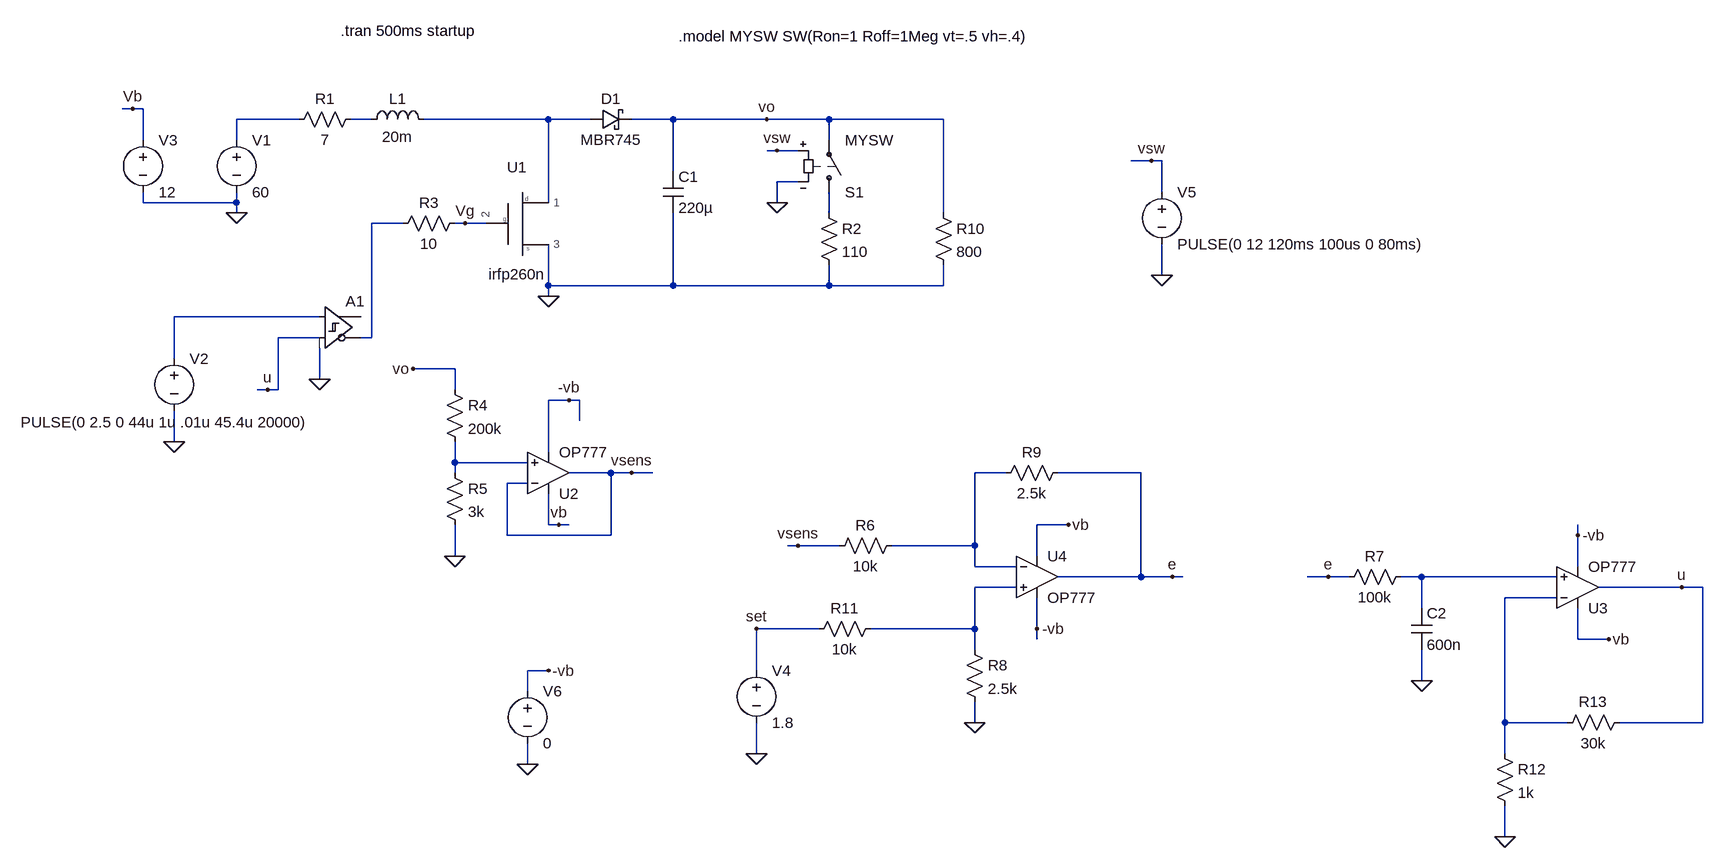
[diagram p0: schematic boost_control_integrator2.asc]
boost_control_integrator2.asc, the LTspice schematic file:
Version 4
SHEET 1 2184 1188
WIRE -240 48 -256 48
WIRE -224 48 -240 48
WIRE 16 64 -80 64
WIRE 128 64 96 64
WIRE 400 64 208 64
WIRE 464 64 400 64
WIRE 592 64 528 64
WIRE 736 64 592 64
WIRE 832 64 736 64
WIRE 1008 64 832 64
WIRE -224 96 -224 48
WIRE -80 96 -80 64
WIRE 832 96 832 64
WIRE 752 112 736 112
WIRE 784 112 752 112
WIRE 1328 128 1296 128
WIRE 1344 128 1328 128
WIRE 592 144 592 64
WIRE 784 160 752 160
WIRE 1344 176 1344 128
WIRE -224 192 -224 176
WIRE -80 192 -80 176
WIRE -80 192 -224 192
WIRE 400 192 400 64
WIRE 752 192 752 160
WIRE -80 208 -80 192
WIRE 832 208 832 176
WIRE 1008 208 1008 64
WIRE 176 224 128 224
WIRE 272 224 256 224
WIRE 304 224 272 224
WIRE 1344 304 1344 256
WIRE 400 320 400 256
WIRE 592 320 592 208
WIRE 592 320 400 320
WIRE 832 320 832 288
WIRE 832 320 592 320
WIRE 1008 320 1008 288
WIRE 1008 320 832 320
WIRE 400 336 400 320
WIRE 48 368 -176 368
WIRE 48 400 -16 400
WIRE 128 400 128 224
WIRE 128 400 112 400
WIRE -176 432 -176 368
WIRE 256 448 192 448
WIRE 48 464 48 416
WIRE -32 480 -48 480
WIRE -16 480 -16 400
WIRE -16 480 -32 480
WIRE 256 480 256 448
WIRE 432 496 400 496
WIRE 448 496 432 496
WIRE 448 528 448 496
WIRE -176 560 -176 512
WIRE 400 576 400 496
WIRE 256 592 256 560
WIRE 368 592 256 592
WIRE 256 608 256 592
WIRE 496 608 432 608
WIRE 528 608 496 608
WIRE 560 608 528 608
WIRE 1104 608 1056 608
WIRE 1312 608 1184 608
WIRE 368 624 336 624
WIRE 400 688 400 640
WIRE 416 688 400 688
WIRE 432 688 416 688
WIRE 1200 688 1152 688
WIRE 336 704 336 624
WIRE 496 704 496 608
WIRE 496 704 336 704
WIRE 1984 704 1984 688
WIRE 784 720 768 720
WIRE 848 720 784 720
WIRE 1056 720 1056 608
WIRE 1056 720 928 720
WIRE 256 736 256 688
WIRE 1152 736 1152 688
WIRE 1056 752 1056 720
WIRE 1120 752 1056 752
WIRE 1984 752 1984 704
WIRE 1312 768 1312 608
WIRE 1312 768 1184 768
WIRE 1360 768 1312 768
WIRE 1376 768 1360 768
WIRE 1600 768 1568 768
WIRE 1632 768 1600 768
WIRE 1744 768 1712 768
WIRE 1952 768 1744 768
WIRE 1120 784 1056 784
WIRE 2144 784 2016 784
WIRE 2176 784 2144 784
WIRE 1952 800 1872 800
WIRE 1744 816 1744 768
WIRE 816 848 720 848
WIRE 1056 848 1056 784
WIRE 1056 848 896 848
WIRE 1152 848 1152 800
WIRE 1152 864 1152 848
WIRE 1984 864 1984 816
WIRE 2032 864 1984 864
WIRE 1056 880 1056 848
WIRE 400 912 368 912
WIRE 720 912 720 848
WIRE 1744 928 1744 880
WIRE 368 944 368 912
WIRE 1056 992 1056 960
WIRE 1872 992 1872 800
WIRE 1968 992 1872 992
WIRE 2176 992 2176 784
WIRE 2176 992 2048 992
WIRE 720 1040 720 992
WIRE 1872 1040 1872 992
WIRE 368 1056 368 1024
WIRE 1872 1168 1872 1120
FLAG 400 336 0
FLAG -80 208 0
FLAG 736 64 vo
FLAG 48 464 0
FLAG -176 560 0
FLAG 272 224 Vg
FLAG -32 480 u
FLAG 192 448 vo
FLAG 256 736 0
FLAG -240 48 Vb
FLAG 1200 688 vb
FLAG 720 1040 0
FLAG 1056 992 0
FLAG 528 608 vsens
FLAG 784 720 vsens
FLAG 416 688 vb
FLAG 720 848 set
FLAG 752 192 0
FLAG 752 112 vsw
FLAG 1344 304 0
FLAG 1328 128 vsw
FLAG 368 1056 0
FLAG 400 912 -vb
FLAG 432 496 -vb
FLAG 1152 848 -vb
FLAG 1360 768 e
FLAG 2032 864 vb
FLAG 1984 704 -vb
FLAG 1744 928 0
FLAG 1872 1168 0
FLAG 1600 768 e
FLAG 2144 784 u
SYMBOL voltage -80 80 R0
WINDOW 123 0 0 Left 0
WINDOW 39 0 0 Left 0
SYMATTR InstName V1
SYMATTR Value 60
SYMBOL res 112 48 R90
WINDOW 0 0 56 VBottom 2
WINDOW 3 32 56 VTop 2
SYMATTR InstName R1
SYMATTR Value 7
SYMBOL ind 112 80 R270
WINDOW 0 32 56 VTop 2
WINDOW 3 5 56 VBottom 2
SYMATTR InstName L1
SYMATTR Value 20m
SYMATTR SpiceLine Rser=.5 Rpar=10Meg
SYMBOL cap 576 144 R0
SYMATTR InstName C1
SYMATTR Value 220µ
SYMATTR SpiceLine Rser=.1 Rpar=1Meg
SYMBOL res 816 192 R0
SYMATTR InstName R2
SYMATTR Value 110
SYMBOL res 272 208 R90
WINDOW 0 0 56 VBottom 2
WINDOW 3 32 56 VTop 2
SYMATTR InstName R3
SYMATTR Value 10
SYMBOL schottky 464 80 R270
WINDOW 0 32 32 VTop 2
WINDOW 3 0 32 VBottom 2
SYMATTR InstName D1
SYMATTR Value MBR745
SYMBOL AutoGenerated\\irfp260n 352 224 R0
SYMATTR InstName U1
SYMBOL voltage -176 416 R0
WINDOW 3 -236 114 Left 2
WINDOW 123 0 0 Left 0
WINDOW 39 0 0 Left 0
SYMATTR Value PULSE(0 2.5 0 44u 1u .01u 45.4u 20000)
SYMATTR InstName V2
SYMBOL Digital\\diffschmitt 48 320 R0
SYMATTR InstName A1
SYMATTR SpiceLine Vhigh=12 Vh=0 Vt=0
SYMBOL res 240 464 R0
SYMATTR InstName R4
SYMATTR Value 200k
SYMBOL res 240 592 R0
SYMATTR InstName R5
SYMATTR Value 3k
SYMBOL voltage -224 80 R0
WINDOW 123 0 0 Left 0
WINDOW 39 0 0 Left 0
SYMATTR InstName V3
SYMATTR Value 12
SYMBOL res 944 704 R90
WINDOW 0 0 56 VBottom 2
WINDOW 3 32 56 VTop 2
SYMATTR InstName R6
SYMATTR Value 10k
SYMBOL voltage 720 896 R0
WINDOW 123 0 0 Left 0
WINDOW 39 0 0 Left 0
SYMATTR InstName V4
SYMATTR Value 1.8
SYMBOL res 1040 864 R0
SYMATTR InstName R8
SYMATTR Value 2.5k
SYMBOL res 1200 592 R90
WINDOW 0 0 56 VBottom 2
WINDOW 3 32 56 VTop 2
SYMATTR InstName R9
SYMATTR Value 2.5k
SYMBOL sw 832 192 M180
SYMATTR InstName S1
SYMATTR Value MYSW
SYMBOL res 992 192 R0
SYMATTR InstName R10
SYMATTR Value 800
SYMBOL voltage 1344 160 R0
WINDOW 123 0 0 Left 0
WINDOW 39 0 0 Left 0
SYMATTR InstName V5
SYMATTR Value PULSE(0 12 120ms 100us 0 80ms)
SYMBOL OpAmps\\OP777 1152 704 R0
SYMATTR InstName U4
SYMBOL OpAmps\\OP777 400 672 M180
SYMATTR InstName U2
SYMBOL voltage 368 928 R0
WINDOW 123 0 0 Left 0
WINDOW 39 0 0 Left 0
SYMATTR InstName V6
SYMATTR Value 0
SYMBOL res 912 832 R90
WINDOW 0 0 56 VBottom 2
WINDOW 3 32 56 VTop 2
SYMATTR InstName R11
SYMATTR Value 10k
SYMBOL OpAmps\\OP777 1984 848 M180
SYMATTR InstName U3
SYMBOL res 1728 752 R90
WINDOW 0 0 56 VBottom 2
WINDOW 3 32 56 VTop 2
SYMATTR InstName R7
SYMATTR Value 100k
SYMBOL cap 1728 816 R0
SYMATTR InstName C2
SYMATTR Value 600n
SYMBOL res 1856 1024 R0
SYMATTR InstName R12
SYMATTR Value 1k
SYMBOL res 2064 976 R90
WINDOW 0 0 56 VBottom 2
WINDOW 3 32 56 VTop 2
SYMATTR InstName R13
SYMATTR Value 30k
TEXT 80 -72 Left 2 !.tran 500ms startup
TEXT 600 -64 Left 2 !.model MYSW SW(Ron=1 Roff=1Meg vt=.5 vh=.4)

The netlist it stands for:
* boost_control_integrator2.asc
V1 N001 0 60
R1 N002 N001 7
L1 N002 N003 20m Rser=.5 Rpar=10Meg
C1 vo 0 220µ Rser=.1 Rpar=1Meg
R2 N004 0 110
R3 Vg N005 10
D1 N003 vo MBR745
XU1 N003 Vg 0 irfp260n  ; pins 1 2 3
V2 N006 0 PULSE(0 2.5 0 44u 1u .01u 45.4u 20000)
A1 N006 u 0 0 0 N005 0 0 SCHMITT Vhigh=12 Vh=0 Vt=0
R4 vo N007 200k
R5 N007 0 3k
V3 Vb 0 12
R6 N008 vsens 10k
V4 set 0 1.8
R8 N010 0 2.5k
R9 e N008 2.5k
S1 N004 vo vsw 0 MYSW
R10 vo 0 800
V5 vsw 0 PULSE(0 12 120ms 100us 0 80ms)
XU4 N010 N008 Vb -vb e OP777  ; pins In+ In- V+ V- OUT
XU2 N007 vsens Vb -vb vsens OP777  ; pins In+ In- V+ V- OUT
V6 -vb 0 0
R11 N010 set 10k
XU3 N009 N011 Vb -vb u OP777  ; pins In+ In- V+ V- OUT
R7 N009 e 100k
C2 N009 0 600n
R12 N011 0 1k
R13 u N011 30k
.model D D
.lib standard.dio
.tran 500ms startup
.model MYSW SW(Ron=1 Roff=1Meg vt=.5 vh=.4)
.lib C:\Users\R Esteban A\Documents\LTspiceXVII\BoostConverter\irfp260n.txt
.lib ADI.lib
.backanno
.end